# Altium schematic sheet main.SchDoc
size A3; SheetNumber: 1; SheetTotal: 2
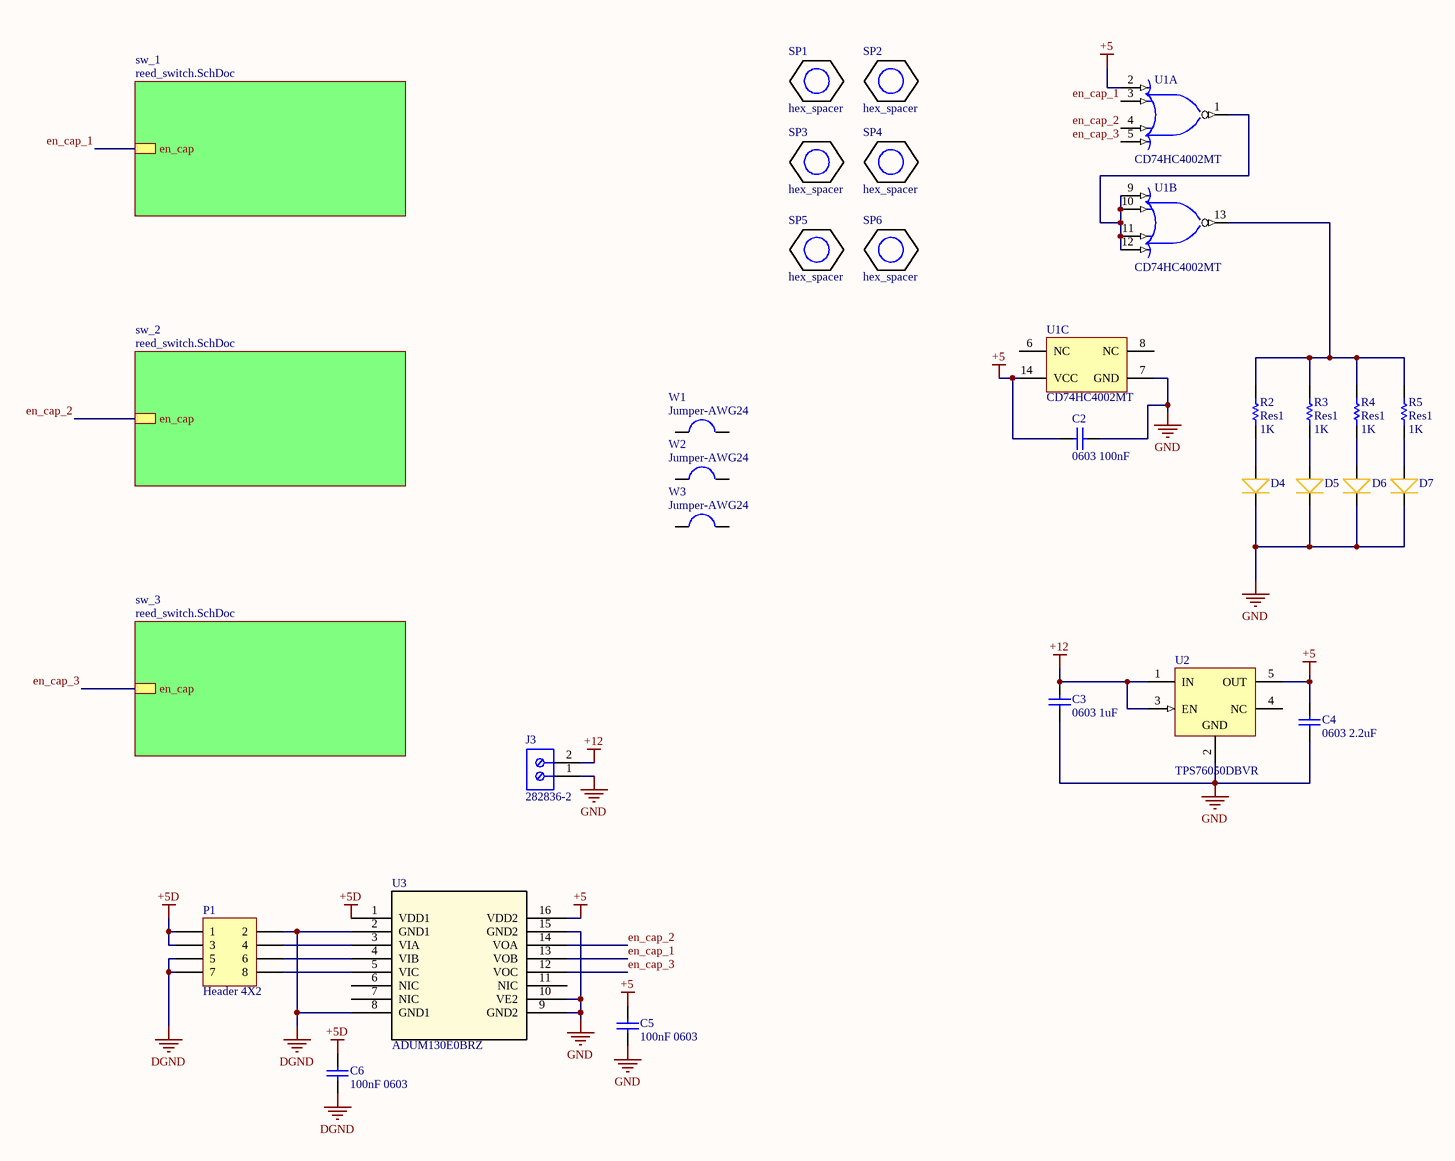
[diagram p0: main.SchDoc]

## Parts
C2  0603 100nF  [CAP 0603_1608]
C3  0603 1uF  [CAP 0603_1608]
C4  0603 2.2uF  [CAP 0603_1608]
C5  100nF 0603  [CAP 0603_1608]
C6  100nF 0603  [CAP 0603_1608]
D4  732-12018-1-ND  [LED_YELLOW_0603]  (value not drawn)
D5  732-12018-1-ND  [LED_YELLOW_0603]  (value not drawn)
D6  732-12018-1-ND  [LED_YELLOW_0603]  (value not drawn)
D7  732-12018-1-ND  [LED_YELLOW_0603]  (value not drawn)
J3  282836-2  [TECO-282836-2_V]
P1  Header 4X2  [HEADER_4_2]
R2  Res1  value 1K  [RES 0603_1608]
R3  Res1  value 1K  [RES 0603_1608]
R4  Res1  value 1K  [RES 0603_1608]
R5  Res1  value 1K  [RES 0603_1608]
SP1  hex_spacer  [hex_spacer]
SP2  hex_spacer  [hex_spacer]
SP3  hex_spacer  [hex_spacer]
SP4  hex_spacer  [hex_spacer]
SP5  hex_spacer  [hex_spacer]
SP6  hex_spacer  [hex_spacer]
U1  CD74HC4002MT  [D0014A_N]  (parts A,B,C of 3)
U2  TPS76050DBVR  [DBV0005A_L]
U3  ADUM130E0BRZ  [R_16]
W1  wire_jumper  [wire_jumper]  (value not drawn)
W2  wire_jumper  [wire_jumper]  (value not drawn)
W3  wire_jumper  [wire_jumper]  (value not drawn)

## Sub-sheets
sw_1 = reed_switch.SchDoc: en_cap
sw_2 = reed_switch.SchDoc: en_cap
sw_3 = reed_switch.SchDoc: en_cap

## Nets
+5: C2.2 C4.2 C5.2 U1.2(1A) U1.14(VCC) U2.5(OUT) U3.16(VDD2)
+5D: C6.2 P1.1 P1.3 U3.1(VDD1)
+12: C3.2 J3.2 U2.1(IN) U2.3(EN)
DGND: C6.1 P1.2 P1.5 P1.7 U3.2(GND1) U3.8(GND1)
GND: C2.1 C3.1 C4.1 C5.1 D4.C D5.C D6.C D7.C J3.1 U1.7(GND) U2.2(GND) U3.9(GND2) U3.10(VE2) U3.15(GND2)
en_cap_1: U1.3(1B) U3.13(VOB) ; sheet sw_1/en_cap
en_cap_2: U1.4(1C) U3.14(VOA) ; sheet sw_2/en_cap
en_cap_3: U1.5(1D) U3.12(VOC) ; sheet sw_3/en_cap
NetD4_A: D4.A R2.1
NetD5_A: D5.A R3.1
NetD6_A: D6.A R4.1
NetD7_A: D7.A R5.1
NetP1_4: P1.4 U3.3(VIA)
NetP1_6: P1.6 U3.4(VIB)
NetP1_8: P1.8 U3.5(VIC)
NetR2_2: R2.2 R3.2 R4.2 R5.2 U1.13(2Y)
NetU1_1: U1.1(1Y) U1.9(2A) U1.10(2B) U1.11(2C) U1.12(2D)

Not connected (* = marked no-connect by the designer): U1 6(NC) 8(NC); U2 4(NC); U3 6(NIC) 7(NIC) 11(NIC); W1 1 2; W2 1 2; W3 1 2

## Notes on the sheet
- 1
- 2
- 3
- 4
- 5
- 6
- 7
- 8
- A
- B
- C
- D
- Project:
- Date:
- Drawing number:
- Rev:
- Format:
- A3
- Drawn by:
- Laboratory:
- Page
- Sheet:
- of
- File:
- (in symbol wire_jumper) Jumper-AWG24

## Library data of the parts
C2-C6 = Cap: Capacitor; Published: 8-Jun-2000; LatestRevisionDate: 17-Jul-2002; LatestRevisionNote: Re-released for DXP Platform.; PackageReference: RAD-0.3; Publisher: Altium Limited; PackageDescription: Radial Cap, Thru-Hole; 2 Leads; 0.3 in Pin Spacing
  C5 C6: Value: 100nF
D4-D7 = led_yellow_0603: Supplier 1: Digi-Key; Supplier Part Number 1: 732-12018-1-ND
J3 = CMP-1684-00017-1: Female Header, Pitch 5 mm, 1 x 2 Position, Height 10 mm, Tail Length 3.5 mm, Rohs, Bulk; Manufacturer: TE Connectivity; Wire Gauge: 16-30AWG; Product Training Modules: Wire-to-BoardEurostyleTerminalBlocks; Clamp Material - Plating: Brass-NickelPlated; Voltage: 300V; Mating Orientation: HorizontalwithBoard; Current: 13.5A; Pitch: 0.197"(5.00mm); Screw Thread: M3; 3D Model: 282836-2.pdf; Other Names: 5ULV-02B / A98076; Dynamic Catalog: BuchananSeries; Number of Levels: 1; Torque - Screw: 0.68Nm(6Lb-In); Featured Product: EurostyleTerminalBlockConnectors; Positions Per Level: 2; Wire Termination: Screw-RisingCageClamp; Datasheet URL: http://www.te.com.cn/commerce/DocumentDelivery/DDEController?Action=showdoc&DocId=Catalog+Section%7F1308389_EUROSTYLE_TERMINAL_BLOCKS%7F0607%7Fpdf%7FEnglish%7FENG_CS_1308389_EUROSTYLE_TERMINAL_BLOCKS_0607.pdf%7F282836-2; Color: Green; Family: TerminalBlocks-WiretoBoard; RoHS Information: 282836-2StatementofCompliance; Standard Package: 300; Contact Material - Plating: Brass-TinPlated; Manufacturer URL: http://www.te.com; Housing Material: Polyamide(PA66),Nylon6/6; Features: Interlocking(Side); Package Description: Female Header, Pitch 5 mm, 1 x 2 Position, Height 10 mm, Tail Length 3.5 mm; Mounting Type: ThroughHole; Package Reference: THD; Packaging: Bulk; Series: Buchanan; Category: Connectors,Interconnects; Screw Material - Plating: Brass-NickelPlated
P1 = Header 4X2: Header, 4-Pin, Dual row; LatestRevisionDate: 17-Jul-2002; LatestRevisionNote: Re-released for DXP Platform.; Publisher: Altium Limited
R2-R5 = Res1: Resistor; Published: 8-Jun-2000; LatestRevisionDate: 17-Jul-2002; LatestRevisionNote: Re-released for DXP Platform.; PackageReference: AXIAL-0.3; Publisher: Altium Limited; PackageDescription: Axial Device, Thru-Hole; 2 Leads; 0.3 in Pin Spacing
U1 = CMP-0806-00012-3: High Speed CMOS Logic Dual 4-Input NOR Gates, D0014A, SMALL T&R; Manufacturer: Texas Instruments; tpd @ Nom Voltage(Max)(ns): 25; Rating: Catalog; VCC(Min)(V): 2; VCC(Max)(V): 6; Voltage(Nom)(V): 5; Output Drive (IOL/IOH)(Max)(mA): 5.2/-5.2; F @ Nom Voltage(Max)(Mhz): 70; ICC @ Nom Voltage(Max)(mA): 0.02; Code_JEDEC: MS-012; DatasheetVersion: SCHS197E; Operating Temperature Range(C): -55 to 125; PackageVersion: http://www.ti.com/lit/ml/mpds177g/mpds177g.pdf; Input Type: CMOS; Output Type: CMOS; Generic Part Number: CD74HC4002; Bits(#): 2; PackageReference: D0014A
U2 = CMP-0394-00477-2: Single Output LDO, 50 mA, Fixed 5 V Output, 5.2 to 16 V Input, with Low IQ, 5-pin SOT-23 (DBV), -40 to 125 degC, Green (RoHS & no Sb/Br); Manufacturer: Texas Instruments; Rating: Catalog; Fixed Output Options(V): 5; Vdo(Typ)(mV): 120; SubFamily: Single Channel LDO; Vin(Max)(V): 16; Accuracy(%): 2; Vin(Min)(V): 5.2; Iq(Typ)(mA): 0.8; Iout(Max)(A): 0.05; Mounting Technology: Surface Mount; ComponentLink1Description: Manufacturer URL; ComponentLink2URL: http://www.ti.com/general/docs/lit/getliterature.tsp?genericPartNumber=TPS76050&fileType=pdf; ComponentLink1URL: http://www.ti.com/; Vout Adj(Max)(V): 5; ComponentLink2Description: Datasheet; PackageReference: DBV0005A; Code_JEDEC: MO-178; Eco-Plan: Green (RoHS & no Sb/Br); ComponentLink3URL: http://www.ti.com/litv/pdf/mpds018i; PackageVersion: 4073253-4/K; ComponentLink3Description: Package Specification; PartNumber: TPS76050DBVR; Vout Adj(Min)(V): 5; PackageDescription: 5-Pin Plastic Small Outline, Body 1.60 Ãƒâ€” 2.90 mm, Pitch 0.95 mm; DatasheetVersion: SLVS144D
U3 = ADUM130E0BRZ: No Description Available; Mfr_Name: Analog Devices Inc; Copyright: Copyright (C) 2021 Ultra Librarian. All rights reserved.; Manufacturer_Part_Number: ADUM130E0BRZ; Digi-Key_Part_Number_1: ADUM130E0BRZ-ND; RefDes: RefDes; Type: DEV